# EAGLE design lidar_node (EAGLE 7.7.0)
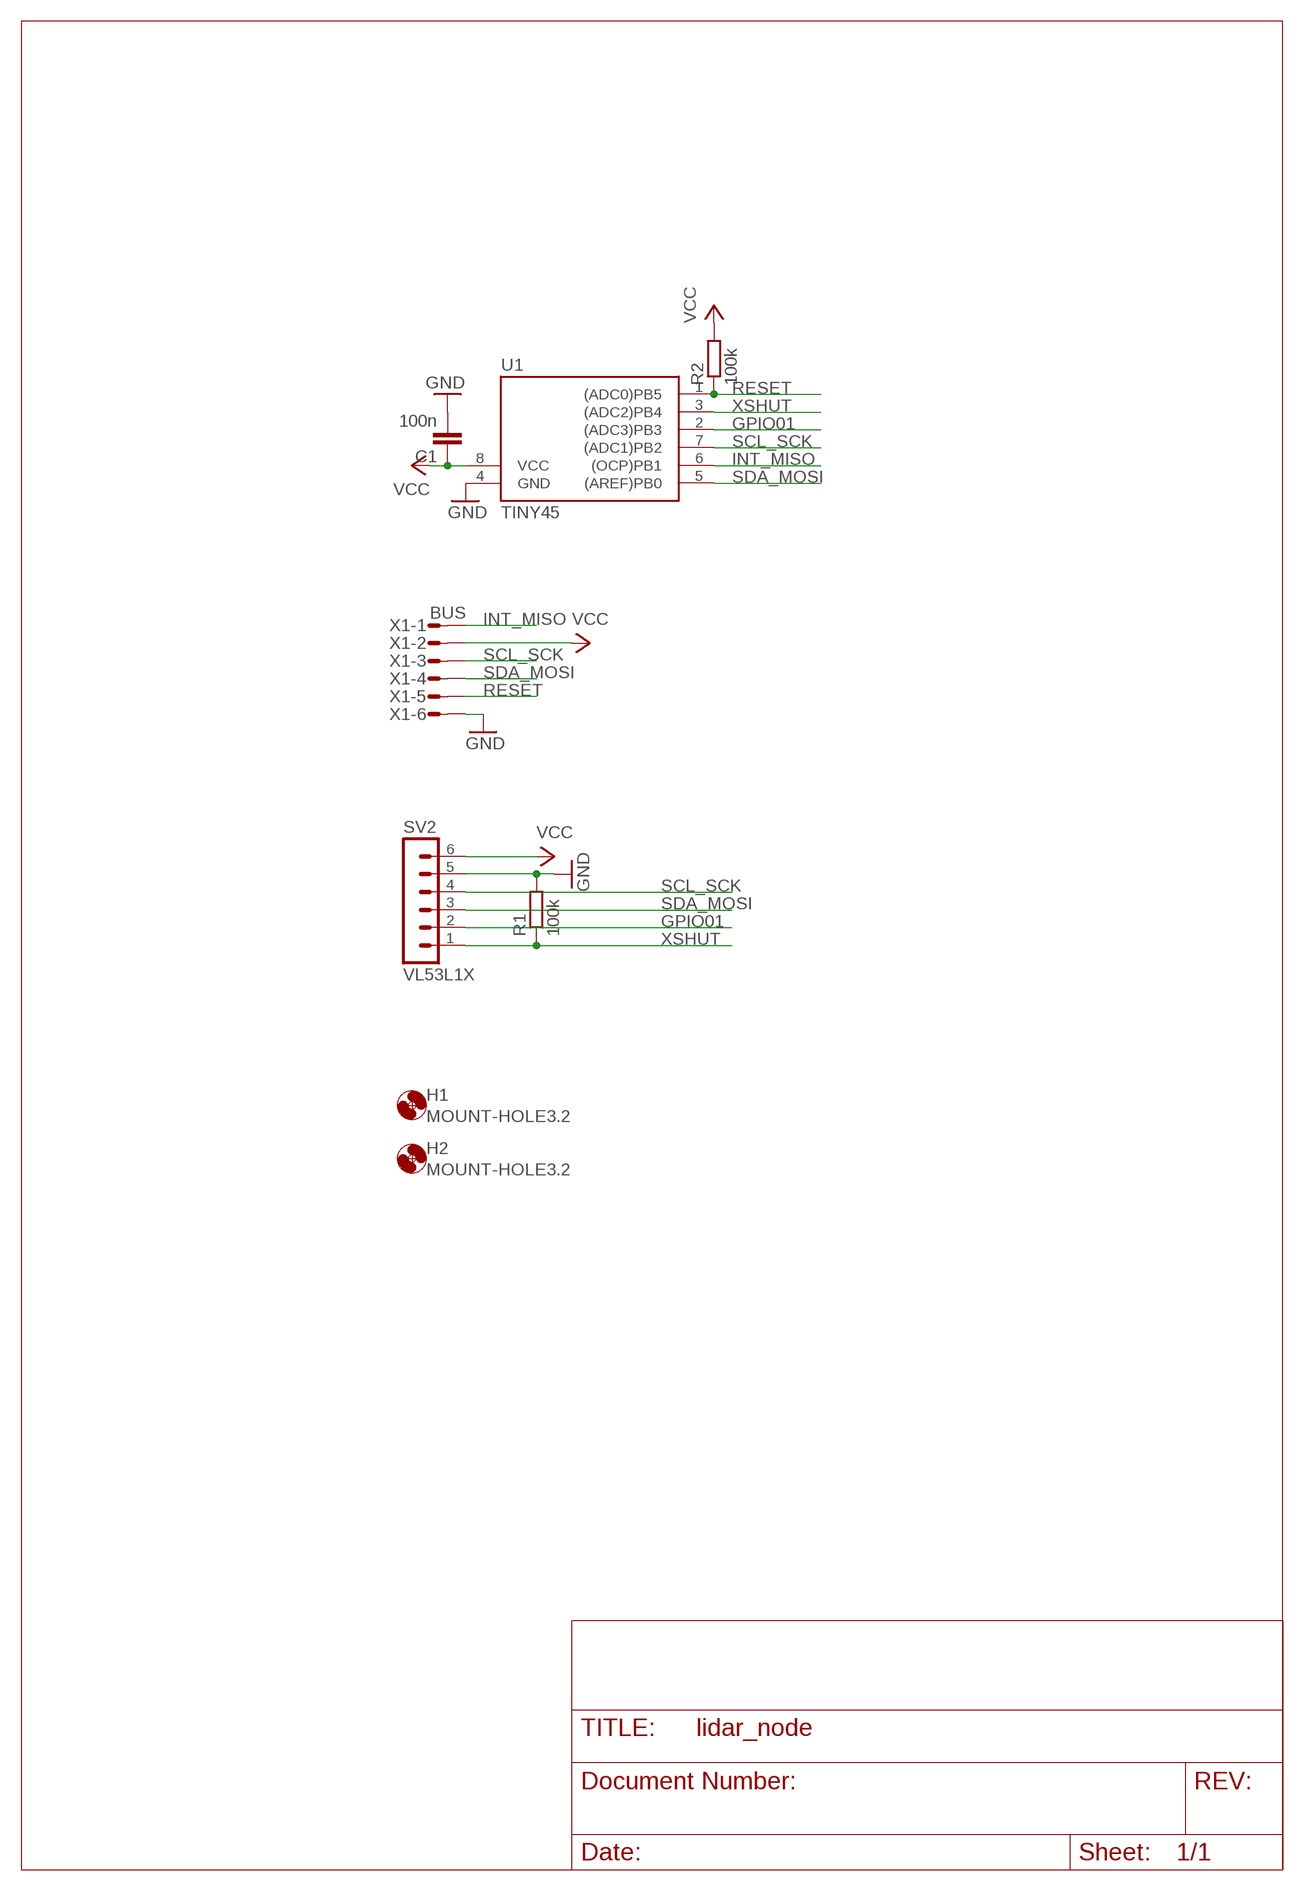
[diagram p0: schematic, sheet 1]

## Parts
C1  100n  C-EUC0805  [C0805]
H1  MOUNT-HOLE3.2  [3,2]
H2  MOUNT-HOLE3.2  [3,2]
R1  100k  R-EU_M0805  [M0805]
R2  100k  R-EU_M0805  [M0805]
SV2  VL53L1X  MA06-1  [MA06-1]
U1  TINY45  TINY25/45/85-20SU  [SOIC8]
X1  BUS  MICROMATCH-6  [MICROMATCH-6]

## Nets
GND: C1.2 R1.2 SV2.5 U1.4(GND) X1.6
GPIO01: SV2.2 U1.2((ADC3)PB3)
INT_MISO: U1.6((OCP)PB1) X1.1
RESET: R2.1 U1.1((ADC0)PB5) X1.5
SCL_SCK: SV2.4 U1.7((ADC1)PB2) X1.3
SDA_MOSI: SV2.3 U1.5((AREF)PB0) X1.4
VCC: C1.1 R2.2 SV2.6 U1.8(VCC) X1.2
XSHUT: R1.1 SV2.1 U1.3((ADC2)PB4)

## Library data of the parts
C1 = rcl:C-EU: CAPACITOR, European symbol
H1 H2 = holes:MOUNT-HOLE: MOUNTING HOLE with drill center marker
R1 R2 = rcl:R-EU_: RESISTOR, European symbol
SV2 = con-lstb:MA06-1: PIN HEADER; OC_FARNELL: unknown; OC_NEWARK: unknown
U1 = avr-7:TINY25/45/85
X1 = con-amp-micromatch:MICROMATCH-6: MicroMaTch 6 7-215464-6 / 0-215464-6 Drawing Number C-215464 DDEController.pdf; MPN: 7-215464-6; OC_FARNELL: 3784630; OC_NEWARK: 19R8125

## Board
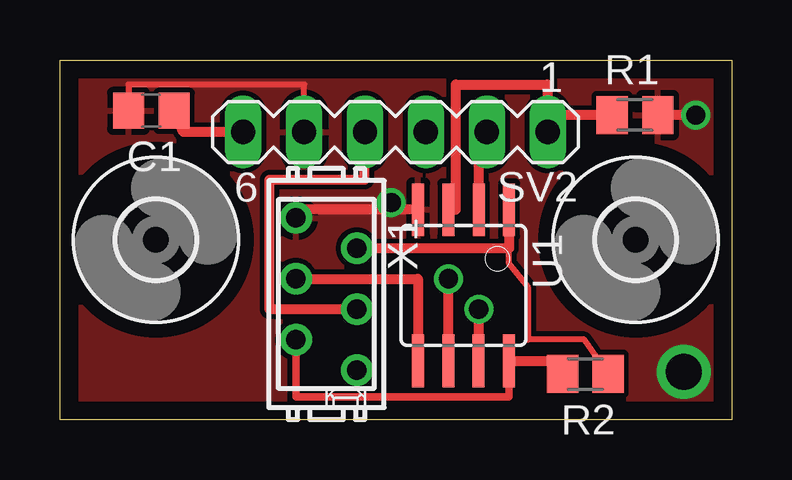
[diagram p1: board, top side]
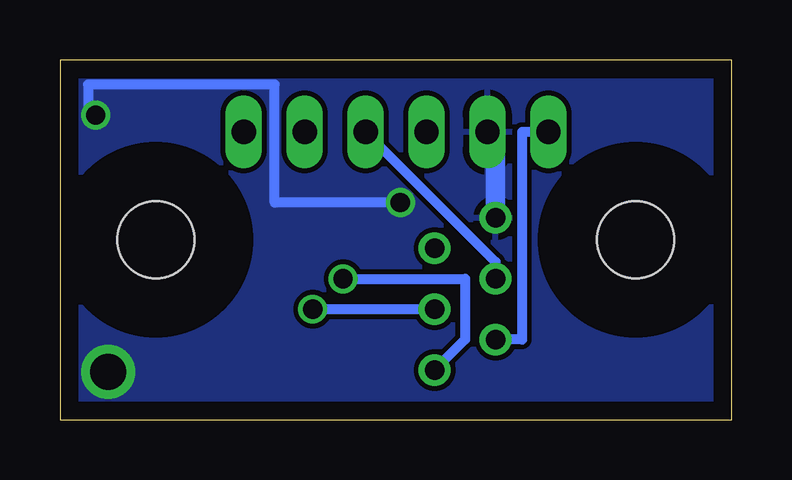
[diagram p2: board, bottom side, seen from below]

Size 28 x 15 mm. Coordinates in mm from the lower left corner, seen from the top.
Outline: 0,0 0,15 28,15 28,0 0,0
Copper layers (1*16): Top 0.035mm / dielectric 1.5mm / Bottom 0.035mm
Design rules "default *": minimum track width 10mil, minimum drill 24mil, track to track 8mil, track to pad 8mil, pad to pad 8mil, via to via 8mil, smd to smd 8mil, copper to edge 30mil, drill to drill 8mil, minimum pad ring 10mil, minimum via ring 8mil, stop-mask expansion 4mil, vias tented up to drill 0mil, thermal gap 10mil

### Footprints (pad centres in the part's own frame; a part is rotated, then mirrored left to right if it is on the bottom)
C0805 = smd 1.3 x 1.5: 1 -0.95,0; 2 0.95,0
3,2 = hole 3.2: 0,0
M0805 = smd 1.3 x 1.6: 1 -0.95,0; 2 0.95,0
MA06-1 = drill 1.016 long: 1 -6.35,0; 2 -3.81,0; 3 -1.27,0; 4 1.27,0; 5 3.81,0; 6 6.35,0
SOIC8 = smd 0.5 x 2.2: 1 -1.905,-3.154; 2 -0.645,-3.154; 3 0.625,-3.154; 4 1.895,-3.154; 5 1.905,3.154; 6 0.635,3.154; 7 -0.635,3.154; 8 -1.905,3.154
MICROMATCH-6 = drill 0.813: 1 3.175,1.27; 2 1.905,-1.27; 3 0.635,1.27; 4 -0.635,-1.27; 5 -1.905,1.27; 6 -3.175,-1.27

### Placement (x,y rotation side)
C1  3.81,12.88 180 top
H1  24,7.5 0 top
H2  4,7.5 0 top
R1  23.97,12.7 0 top
R2  21.91,1.91 180 top
SV2  13.99,12 180 top
U1  16.82,5.6 180 top
X1  11.11,5.24 270 top

### Tracks (layer width: path | path; a pad name or v marks a point on that pad's centre or on a via)
GND  (via drill 0.8, 1.5)
  Top 0.254: SV2.5 10.18,13.97 2.86,13.97 C1.2
  Top 0.406: X1.6 9.84,8.75 U1.4 13.97,8.75 v13.81,9.05 | v26.51,12.7 R1.2
  Bottom 0.406: v13.81,9.05 19.05,9.05 19.05,13.97 26.83,13.97 26.83,12.7 v26.51,12.7
  Bottom 0.813: SV2.5 9.84,12 X1.6
  other vias: 26,2
  pour Top: 0,0 28,0 28,15 0,15
  pour Bottom: 0,0 28,0 28,15 0,15
GPIO01
  Top 0.406: U1.2 17.47,12 SV2.2
INT_MISO  (via drill 0.8)
  Top 0.406: U1.6 v16.19,5.87
  Bottom 0.406: v16.19,5.87 11.11,5.87 11.11,3.33 X1.1
RESET
  Top 0.254: R2.1 21.86,3.33 19.53,3.33 19.53,5.51 18.73,6.51 U1.1
  Top 0.406: U1.1 18.73,7.14 X1.5
SCL_SCK  (via drill 0.8)
  Top 0.406: v17.46,4.6 U1.7 | X1.3 8.73,4.6 8.73,10 12.7,10 12.7,12 SV2.4
  Bottom 0.406: X1.3 v17.46,4.6
SDA_MOSI
  Top 0.406: X1.4 14.92,5.87 U1.5
  Bottom 0.406: X1.4 9.84,6.58 SV2.3
VCC
  Top 0.305: U1.8 18.73,0.95 9.84,0.95 X1.2
  Top 0.406: SV2.6 5.15,12 C1.1 | U1.8 21.12,2.44 R2.2
  Bottom 0.406: SV2.6 8.73,12 8.73,3.33 X1.2
XSHUT
  Top 0.254: 20.32,12 SV2.1
  Top 0.406: R1.1 20.34,12.7 SV2.1 | U1.3 16.51,8.75 16.51,13.97 20.32,13.97 20.32,12